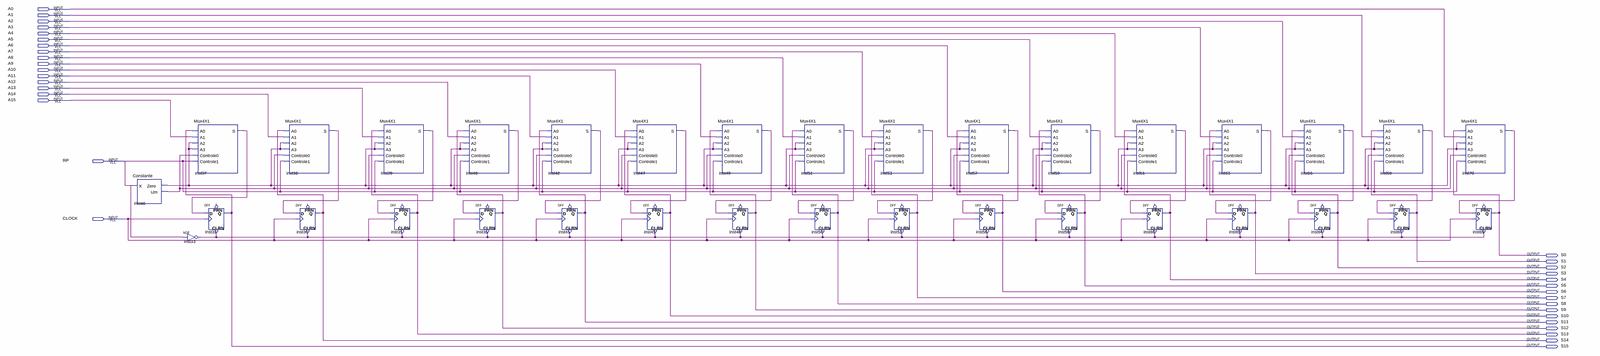
[diagram p0: schematic sheet, whole]
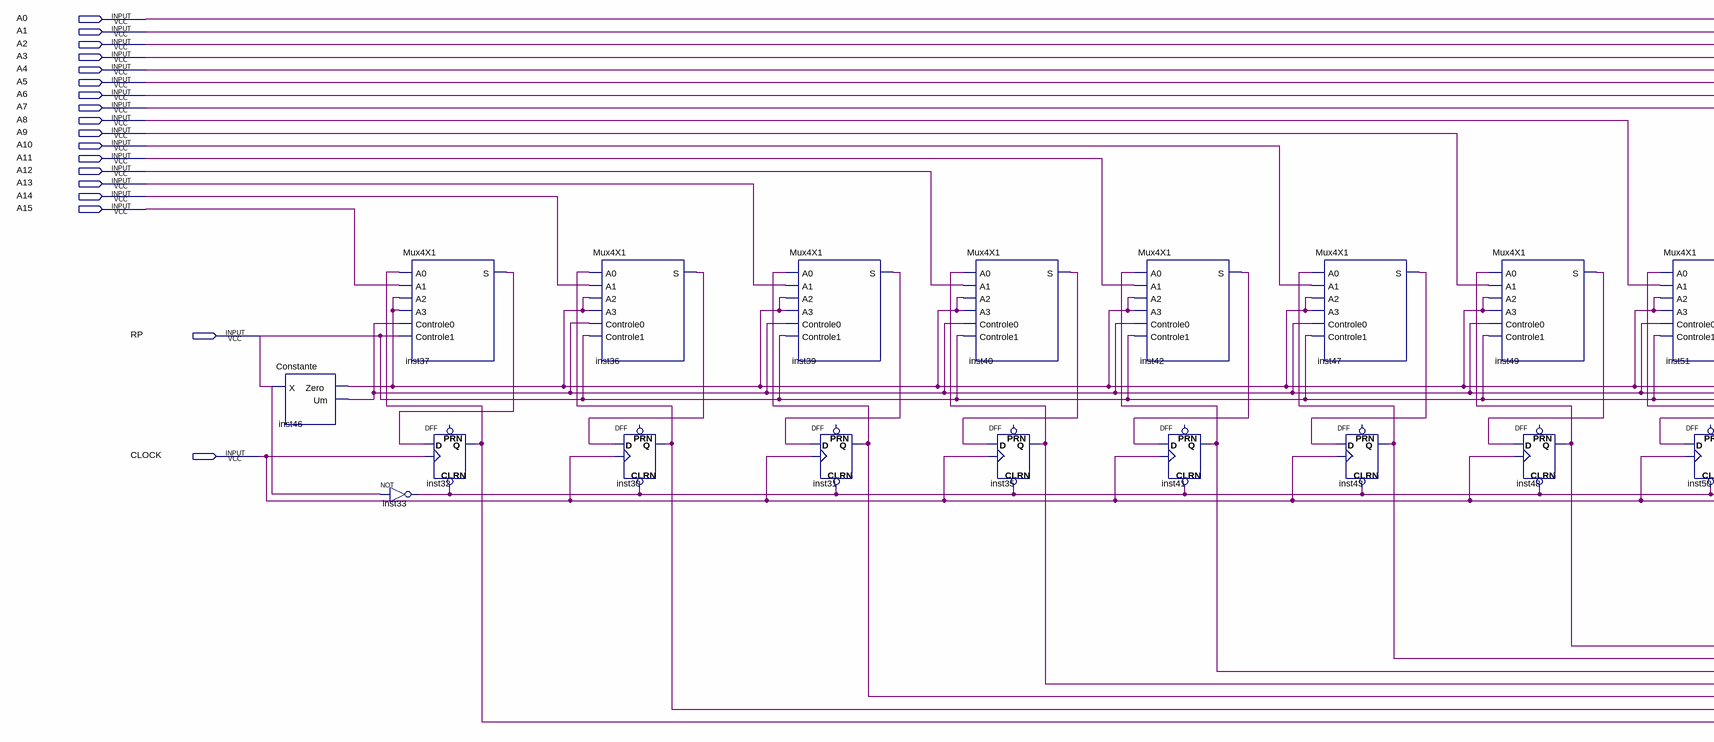
[diagram p1: schematic sheet, left part]
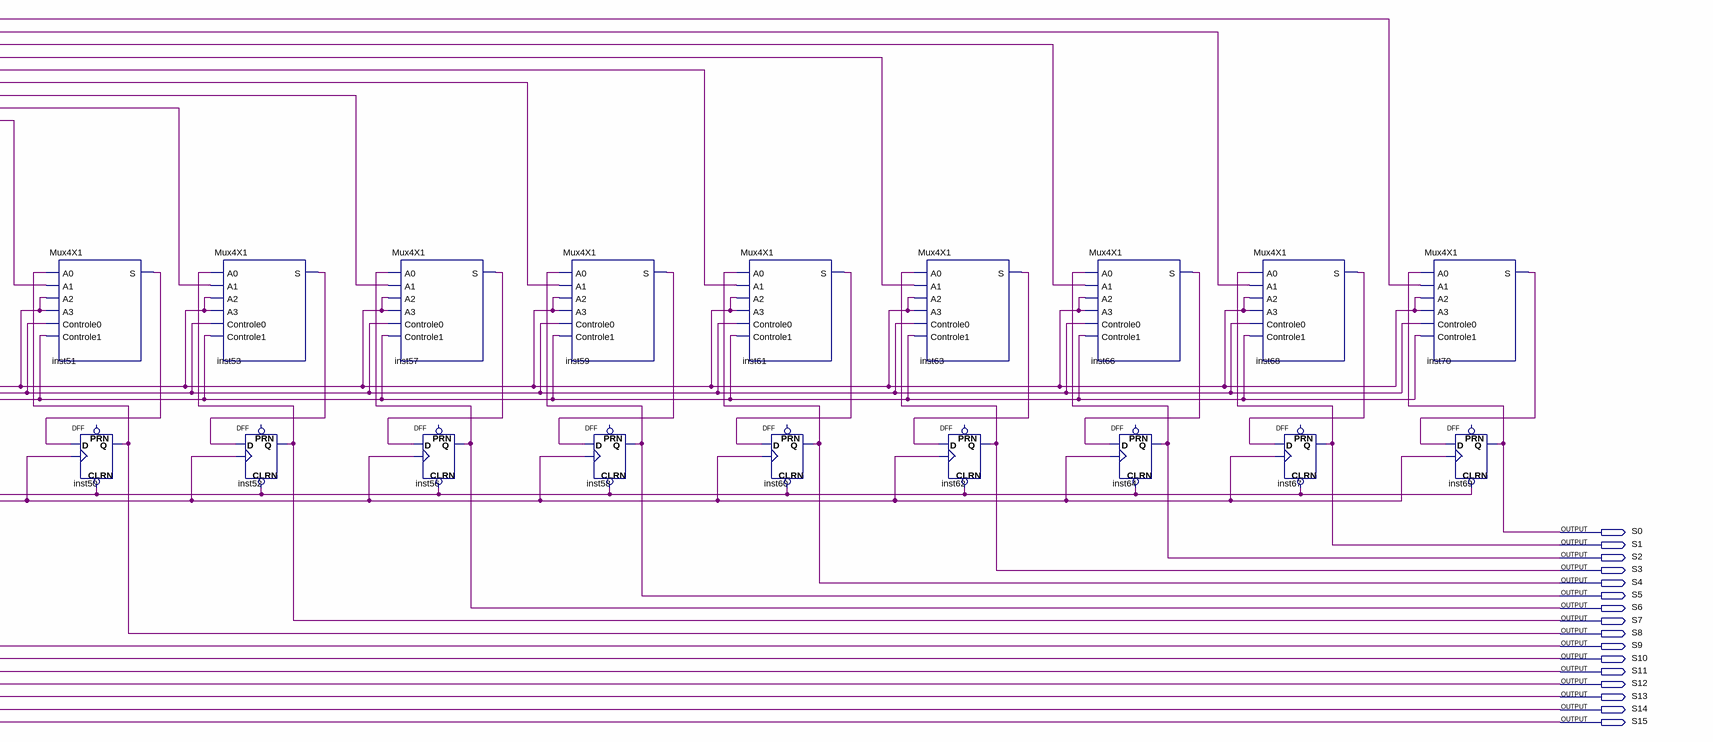
[diagram p2: schematic sheet, right part]
// Quartus schematic Registrador16B.bdf as structural Verilog: 34 symbols, 34 pins
module Registrador16B (
  input  A0,
  input  A1,
  input  A2,
  input  A3,
  input  A4,
  input  A5,
  input  A6,
  input  A7,
  input  A8,
  input  A9,
  input  A10,
  input  A11,
  input  A12,
  input  A13,
  input  A14,
  input  A15,
  input  RP,
  input  CLOCK,
  output S0,
  output S1,
  output S2,
  output S3,
  output S4,
  output S5,
  output S6,
  output S7,
  output S8,
  output S9,
  output S10,
  output S11,
  output S12,
  output S13,
  output S14,
  output S15
);

  wire inst33_out, inst36_s, inst37_s, inst39_s, inst40_s, inst42_s, inst46_um, inst46_zero, inst47_s,
       inst49_s, inst51_s, inst53_s, inst57_s, inst59_s, inst61_s, inst63_s, inst66_s, inst68_s, inst70_s;

  Constante inst46 (.X(RP), .Zero(inst46_zero), .Um(inst46_um));
  Mux4X1 inst37 (
    .A0(S15), .A1(A15), .A2(inst46_zero), .A3(inst46_zero), .Controle0(inst46_um), .Controle1(RP),
    .S(inst37_s));
  not inst33 (inst33_out, RP);
  DFF inst32 (.CLRN(inst33_out), .CLK(CLOCK), .D(inst37_s), .Q(S15));  // open: PRN
  Mux4X1 inst36 (
    .A0(S14), .A1(A14), .A2(inst46_zero), .A3(inst46_zero), .Controle0(inst46_um), .Controle1(RP),
    .S(inst36_s));
  DFF inst30 (.CLRN(inst33_out), .CLK(CLOCK), .D(inst36_s), .Q(S14));  // open: PRN
  Mux4X1 inst39 (
    .A0(S13), .A1(A13), .A2(inst46_zero), .A3(inst46_zero), .Controle0(inst46_um), .Controle1(RP),
    .S(inst39_s));
  DFF inst31 (.CLRN(inst33_out), .CLK(CLOCK), .D(inst39_s), .Q(S13));  // open: PRN
  Mux4X1 inst40 (
    .A0(S12), .A1(A12), .A2(inst46_zero), .A3(inst46_zero), .Controle0(inst46_um), .Controle1(RP),
    .S(inst40_s));
  DFF inst35 (.CLRN(inst33_out), .CLK(CLOCK), .D(inst40_s), .Q(S12));  // open: PRN
  Mux4X1 inst42 (
    .A0(S11), .A1(A11), .A2(inst46_zero), .A3(inst46_zero), .Controle0(inst46_um), .Controle1(RP),
    .S(inst42_s));
  DFF inst41 (.CLRN(inst33_out), .CLK(CLOCK), .D(inst42_s), .Q(S11));  // open: PRN
  Mux4X1 inst47 (
    .A0(S10), .A1(A10), .A2(inst46_zero), .A3(inst46_zero), .Controle0(inst46_um), .Controle1(RP),
    .S(inst47_s));
  DFF inst43 (.CLRN(inst33_out), .CLK(CLOCK), .D(inst47_s), .Q(S10));  // open: PRN
  Mux4X1 inst49 (
    .A0(S9), .A1(A9), .A2(inst46_zero), .A3(inst46_zero), .Controle0(inst46_um), .Controle1(RP), .S(inst49_s));
  DFF inst48 (.CLRN(inst33_out), .CLK(CLOCK), .D(inst49_s), .Q(S9));  // open: PRN
  Mux4X1 inst51 (
    .A0(S8), .A1(A8), .A2(inst46_zero), .A3(inst46_zero), .Controle0(inst46_um), .Controle1(RP), .S(inst51_s));
  DFF inst50 (.CLRN(inst33_out), .CLK(CLOCK), .D(inst51_s), .Q(S8));  // open: PRN
  Mux4X1 inst53 (
    .A0(S7), .A1(A7), .A2(inst46_zero), .A3(inst46_zero), .Controle0(inst46_um), .Controle1(RP), .S(inst53_s));
  DFF inst52 (.CLRN(inst33_out), .CLK(CLOCK), .D(inst53_s), .Q(S7));  // open: PRN
  Mux4X1 inst57 (
    .A0(S6), .A1(A6), .A2(inst46_zero), .A3(inst46_zero), .Controle0(inst46_um), .Controle1(RP), .S(inst57_s));
  DFF inst56 (.CLRN(inst33_out), .CLK(CLOCK), .D(inst57_s), .Q(S6));  // open: PRN
  Mux4X1 inst59 (
    .A0(S5), .A1(A5), .A2(inst46_zero), .A3(inst46_zero), .Controle0(inst46_um), .Controle1(RP), .S(inst59_s));
  DFF inst58 (.CLRN(inst33_out), .CLK(CLOCK), .D(inst59_s), .Q(S5));  // open: PRN
  Mux4X1 inst61 (
    .A0(S4), .A1(A4), .A2(inst46_zero), .A3(inst46_zero), .Controle0(inst46_um), .Controle1(RP), .S(inst61_s));
  DFF inst60 (.CLRN(inst33_out), .CLK(CLOCK), .D(inst61_s), .Q(S4));  // open: PRN
  Mux4X1 inst63 (
    .A0(S3), .A1(A3), .A2(inst46_zero), .A3(inst46_zero), .Controle0(inst46_um), .Controle1(RP), .S(inst63_s));
  DFF inst62 (.CLRN(inst33_out), .CLK(CLOCK), .D(inst63_s), .Q(S3));  // open: PRN
  Mux4X1 inst66 (
    .A0(S2), .A1(A2), .A2(inst46_zero), .A3(inst46_zero), .Controle0(inst46_um), .Controle1(RP), .S(inst66_s));
  DFF inst64 (.CLRN(inst33_out), .CLK(CLOCK), .D(inst66_s), .Q(S2));  // open: PRN
  Mux4X1 inst68 (
    .A0(S1), .A1(A1), .A2(inst46_zero), .A3(inst46_zero), .Controle0(inst46_um), .Controle1(RP), .S(inst68_s));
  DFF inst67 (.CLRN(inst33_out), .CLK(CLOCK), .D(inst68_s), .Q(S1));  // open: PRN
  Mux4X1 inst70 (
    .A0(S0), .A1(A0), .A2(inst46_zero), .A3(inst46_zero), .Controle0(inst46_um), .Controle1(RP), .S(inst70_s));
  DFF inst69 (.CLRN(inst33_out), .CLK(CLOCK), .D(inst70_s), .Q(S0));  // open: PRN
endmodule
